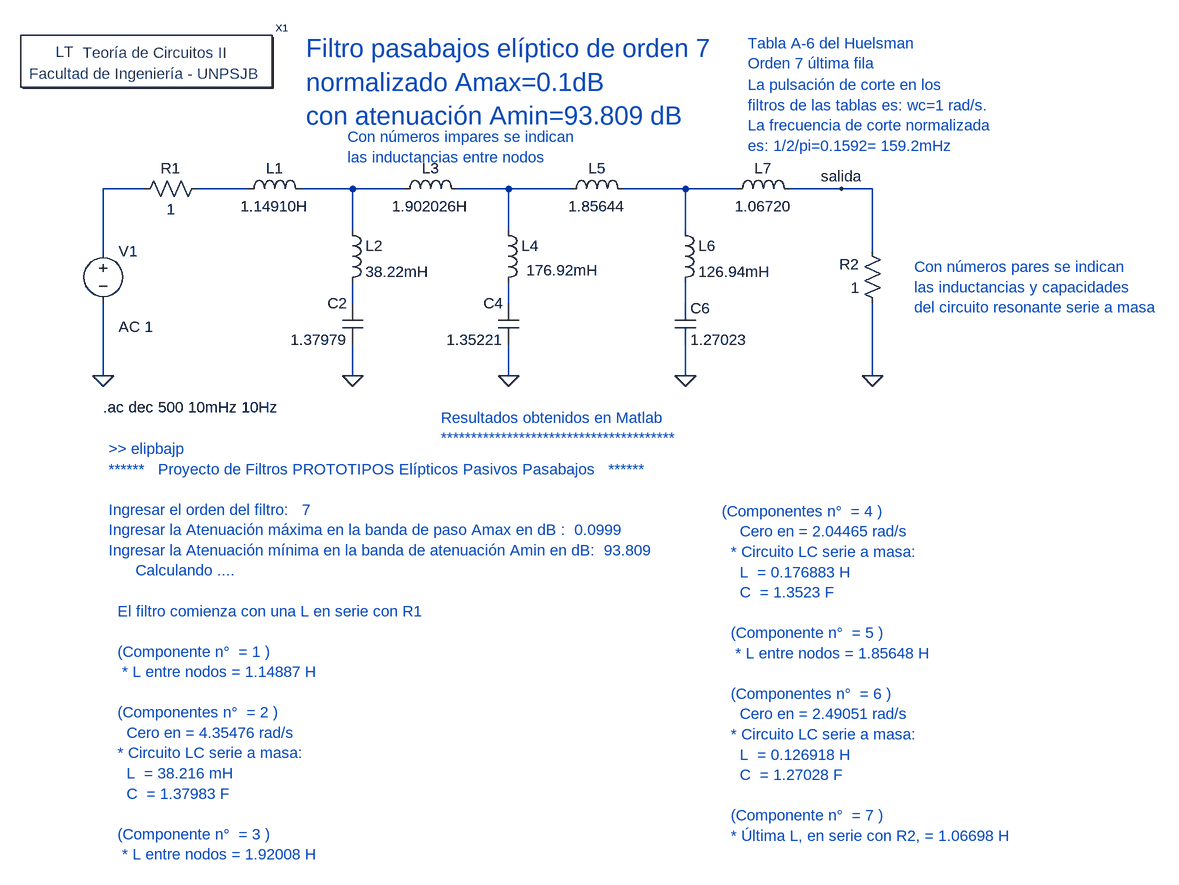
[diagram p0: schematic Filtro eliptico pasabajos de 7 orden normalizado Huelsman tabla A6.asc]
Filtro eliptico pasabajos de 7 orden normalizado Huelsman tabla A6.asc, the LTspice schematic file:
Version 4
SHEET 1 1512 1672
WIRE -256 176 -320 176
WIRE -96 176 -176 176
WIRE 64 176 -16 176
WIRE 144 176 64 176
WIRE 304 176 224 176
WIRE 400 176 304 176
WIRE 576 176 480 176
WIRE 656 176 576 176
WIRE 816 176 736 176
WIRE 864 176 816 176
WIRE 64 240 64 176
WIRE 304 240 304 176
WIRE 576 240 576 176
WIRE -320 272 -320 176
WIRE 864 272 864 176
WIRE 64 352 64 320
WIRE 304 352 304 320
WIRE 576 352 576 320
WIRE -320 464 -320 352
WIRE 64 464 64 416
WIRE 304 464 304 416
WIRE 576 464 576 416
WIRE 864 464 864 352
FLAG 64 464 0
FLAG 304 464 0
FLAG 576 464 0
FLAG 864 464 0
FLAG -320 464 0
FLAG 816 176 salida
SYMBOL voltage -320 256 R0
WINDOW 123 24 132 Left 2
WINDOW 39 0 0 Left 2
SYMATTR Value2 AC 1
SYMATTR InstName V1
SYMATTR Value ""
SYMBOL cap 80 416 R180
WINDOW 0 24 64 Left 2
WINDOW 3 24 8 Left 2
SYMATTR InstName C2
SYMATTR Value 1.37979
SYMBOL cap 320 416 R180
WINDOW 0 24 64 Left 2
WINDOW 3 24 8 Left 2
SYMATTR InstName C4
SYMATTR Value 1.35221
SYMBOL res -160 160 R90
WINDOW 0 0 56 VBottom 2
WINDOW 3 32 56 VTop 2
SYMATTR InstName R1
SYMATTR Value 1
SYMBOL res 880 368 R180
WINDOW 0 36 76 Left 2
WINDOW 3 36 40 Left 2
SYMATTR InstName R2
SYMATTR Value 1
SYMBOL Circuitos2sym\\Letreros\\Teoría\ de\ Circuitos\ II -256 -16 R0
SYMATTR InstName X1
SYMBOL cap 560 352 R0
SYMATTR InstName C6
SYMATTR Value 1.27023
SYMBOL ind -112 192 R270
WINDOW 0 32 56 VTop 2
WINDOW 3 5 56 VBottom 2
SYMATTR InstName L1
SYMATTR Value 1.14910H
SYMBOL ind 48 224 R0
SYMATTR InstName L2
SYMATTR Value 38.22mH
SYMBOL ind 128 192 R270
WINDOW 0 32 56 VTop 2
WINDOW 3 5 56 VBottom 2
SYMATTR InstName L3
SYMATTR Value 1.902026H
SYMBOL ind 288 224 R0
WINDOW 3 43 77 Left 2
SYMATTR InstName L4
SYMATTR Value 176.92mH
SYMBOL ind 384 192 R270
WINDOW 0 32 56 VTop 2
WINDOW 3 5 56 VBottom 2
SYMATTR InstName L5
SYMATTR Value 1.85644
SYMBOL ind 560 224 R0
SYMATTR InstName L6
SYMATTR Value 126.94mH
SYMBOL ind 640 192 R270
WINDOW 0 32 56 VTop 2
WINDOW 3 5 56 VBottom 2
SYMATTR InstName L7
SYMATTR Value 1.06720
TEXT -8 -40 Left 4 ;Filtro pasabajos elíptico de orden 7 \nnormalizado Amax=0.1dB\ncon atenuación Amin=93.809 dB
TEXT -320 512 Left 2 !.ac dec 500 10mHz 10Hz
TEXT 672 -48 Left 2 ;Tabla A-6 del Huelsman\nOrden 7 última fila
TEXT 672 16 Left 2 ;La pulsación de corte en los\nfiltros de las tablas es: wc=1 rad/s.\nLa frecuencia de corte normalizada\nes: 1/2/pi=0.1592= 159.2mHz
TEXT 56 96 Left 2 ;Con números impares se indican\nlas inductancias entre nodos
TEXT 928 296 Left 2 ;Con números pares se indican\nlas inductancias y capacidades\ndel circuito resonante serie a masa
TEXT 632 672 Left 2 ;(Componentes n°  = 4 )\n    Cero en = 2.04465 rad/s\n  * Circuito LC serie a masa:\n    L  = 0.176883 H\n    C  = 1.3523 F\n \n  (Componente n°  = 5 )\n   * L entre nodos = 1.85648 H\n \n  (Componentes n°  = 6 )\n    Cero en = 2.49051 rad/s\n  * Circuito LC serie a masa:\n    L  = 0.126918 H\n    C  = 1.27028 F\n \n  (Componente n°  = 7 )\n  * Última L, en serie con R2, = 1.06698 H
TEXT -312 576 Left 2 ;>> elipbajp\n******   Proyecto de Filtros PROTOTIPOS Elípticos Pasivos Pasabajos   ******\n \nIngresar el orden del filtro:   7\nIngresar la Atenuación máxima en la banda de paso Amax en dB :  0.0999\nIngresar la Atenuación mínima en la banda de atenuación Amin en dB:  93.809\n      Calculando .... \n \n  El filtro comienza con una L en serie con R1\n \n  (Componente n°  = 1 )\n   * L entre nodos = 1.14887 H\n \n  (Componentes n°  = 2 )\n    Cero en = 4.35476 rad/s\n  * Circuito LC serie a masa:\n    L  = 38.216 mH\n    C  = 1.37983 F\n \n  (Componente n°  = 3 )\n   * L entre nodos = 1.92008 H
TEXT 200 528 Left 2 ;Resultados obtenidos en Matlab\n***************************************

The netlist it stands for:
* Filtro eliptico pasabajos de 7 orden normalizado Huelsman tabla A6.asc
V1 N001 0 AC 1
C2 0 N006 1.37979
C4 0 N007 1.35221
R1 N002 N001 1
R2 0 salida 1
XX1 Teoría de Circuitos II
C6 N008 0 1.27023
L1 N002 N003 1.14910H
L2 N003 N006 38.22mH
L3 N003 N004 1.902026H
L4 N004 N007 176.92mH
L5 N004 N005 1.85644
L6 N005 N008 126.94mH
L7 N005 salida 1.06720
* Filtro pasabajos elíptico de orden 7
* normalizado Amax=0.1dB
* con atenuación Amin=93.809 dB
.ac dec 500 10mHz 10Hz
* Tabla A-6 del Huelsman
* Orden 7 última fila
* La pulsación de corte en los
* filtros de las tablas es: wc=1 rad/s.
* La frecuencia de corte normalizada
* es: 1/2/pi=0.1592= 159.2mHz
* Con números impares se indican
* las inductancias entre nodos
* Con números pares se indican
* las inductancias y capacidades
* del circuito resonante serie a masa
* (Componentes n°  = 4 )
*     Cero en = 2.04465 rad/s
*   * Circuito LC serie a masa:
*     L  = 0.176883 H
*     C  = 1.3523 F
*   (Componente n°  = 5 )
*    * L entre nodos = 1.85648 H
*   (Componentes n°  = 6 )
*     Cero en = 2.49051 rad/s
*   * Circuito LC serie a masa:
*     L  = 0.126918 H
*     C  = 1.27028 F
*   (Componente n°  = 7 )
*   * Última L, en serie con R2, = 1.06698 H
* >> elipbajp
* ******   Proyecto de Filtros PROTOTIPOS Elípticos Pasivos Pasabajos   ******
* Ingresar el orden del filtro:   7
* Ingresar la Atenuación máxima en la banda de paso Amax en dB :  0.0999
* Ingresar la Atenuación mínima en la banda de atenuación Amin en dB:  93.809
*       Calculando ....
*   El filtro comienza con una L en serie con R1
*   (Componente n°  = 1 )
*    * L entre nodos = 1.14887 H
*   (Componentes n°  = 2 )
*     Cero en = 4.35476 rad/s
*   * Circuito LC serie a masa:
*     L  = 38.216 mH
*     C  = 1.37983 F
*   (Componente n°  = 3 )
*    * L entre nodos = 1.92008 H
* Resultados obtenidos en Matlab
* ***************************************
.backanno
.end